# EAGLE design Platine_2 (EAGLE 9.6.2)

## Sheet 1 of 2
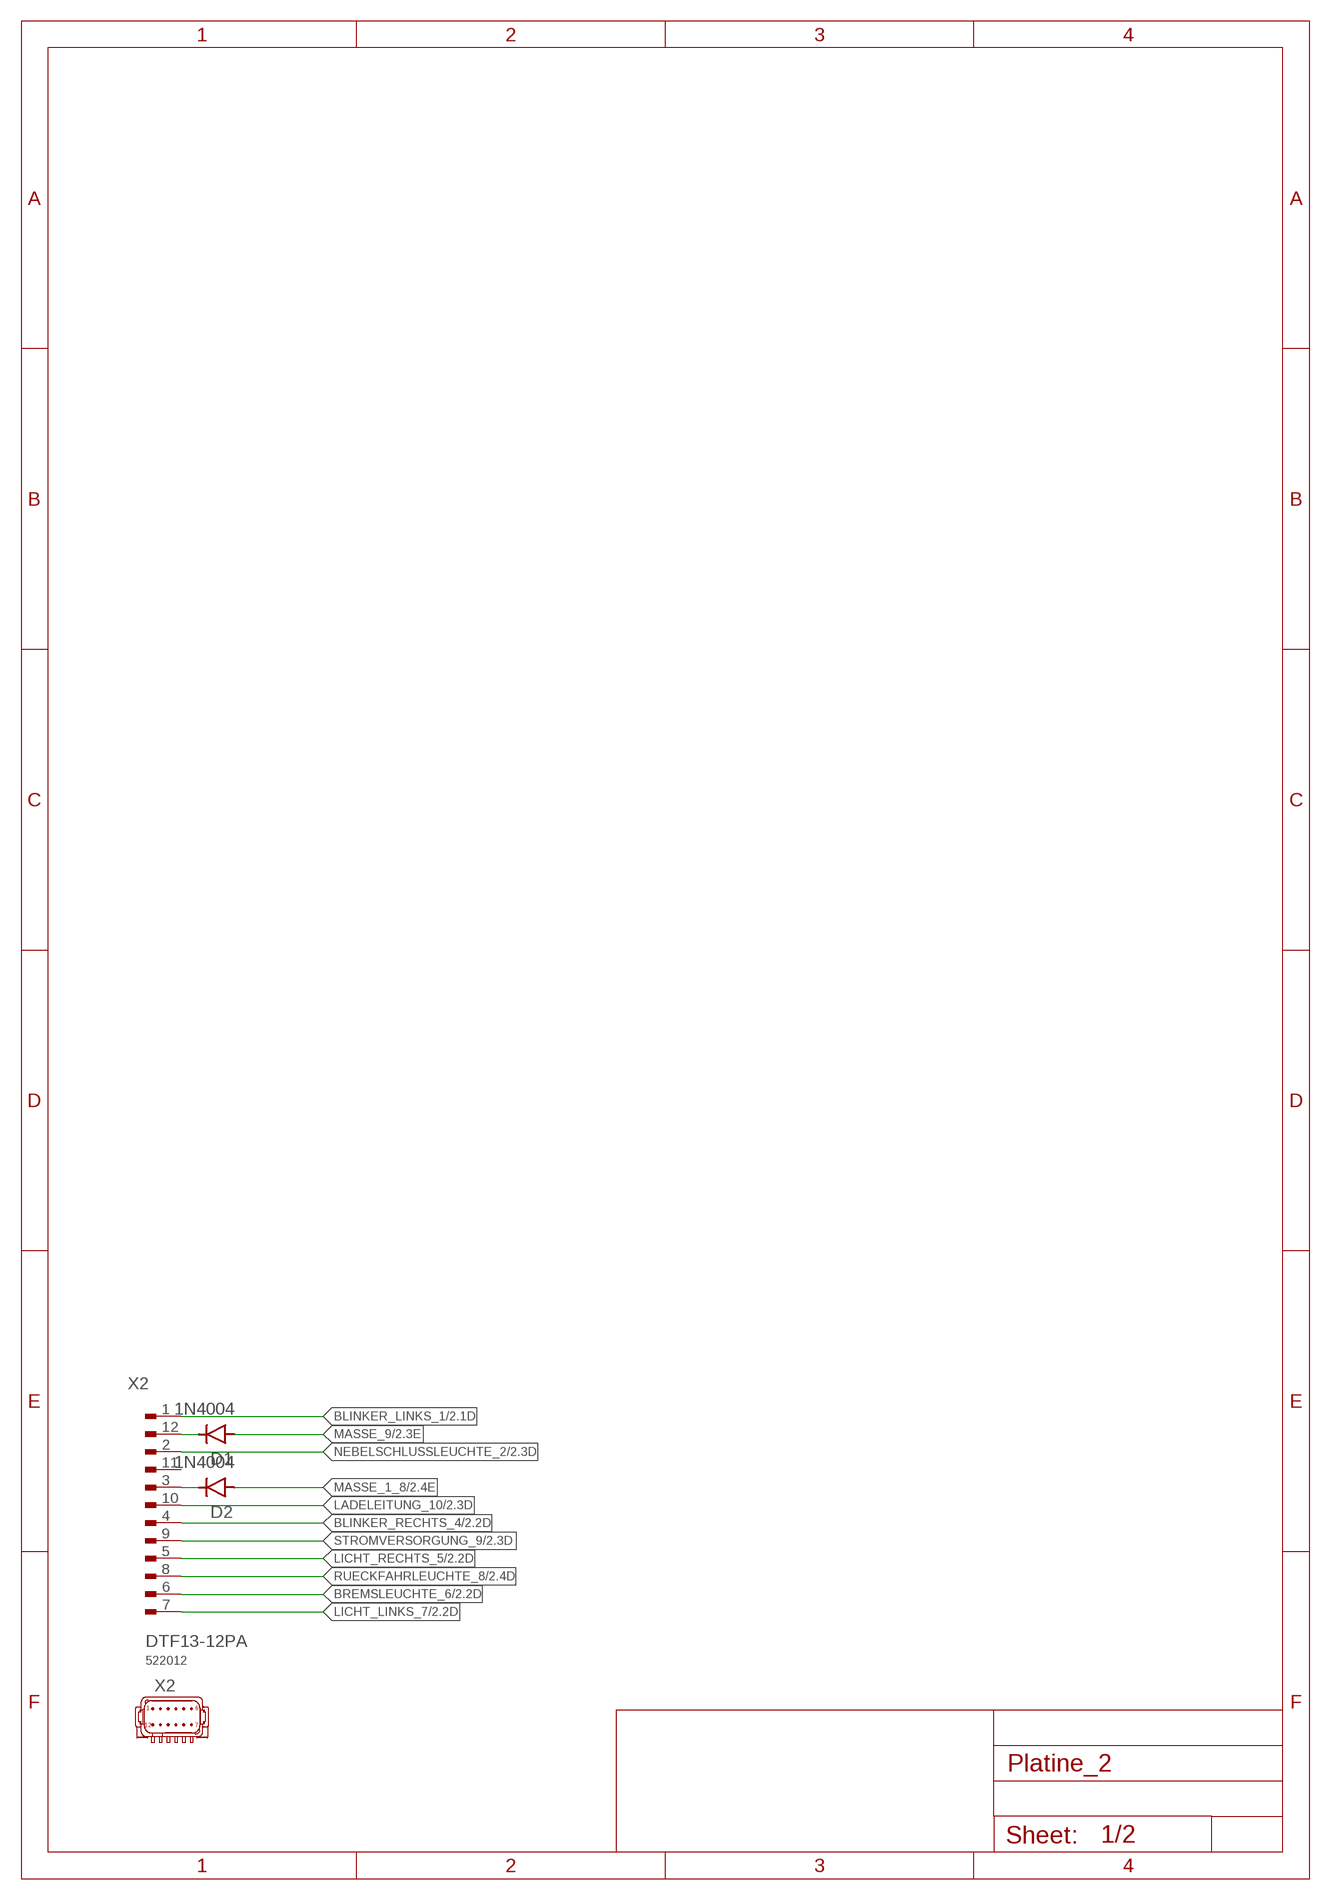
[diagram p0: schematic, sheet 1]

### Parts
D1  1N4004  [DO-41]
D2  1N4004  [DO-41]
X2  DTF13-12PA  [DTF13-12PA]

### Nets
BLINKER_LINKS_1: X2.1 ; also sheet 2
BLINKER_RECHTS_4: X2.4 ; also sheet 2
BREMSLEUCHTE_6: X2.6 ; also sheet 2
LADELEITUNG_10: X2.10 ; also sheet 2
LICHT_LINKS_7: X2.7 ; also sheet 2
LICHT_RECHTS_5: X2.5 ; also sheet 2
MASSE_1_8: D2.A ; also sheet 2
MASSE_9: D1.A ; also sheet 2
N$10: D1.C X2.12
N$11: D2.C X2.3
NEBELSCHLUSSLEUCHTE_2: X2.2 ; also sheet 2
RUECKFAHRLEUCHTE_8: X2.8 ; also sheet 2
STROMVERSORGUNG_9: X2.9 ; also sheet 2
Unconnected: X2.11

## Sheet 2 of 2
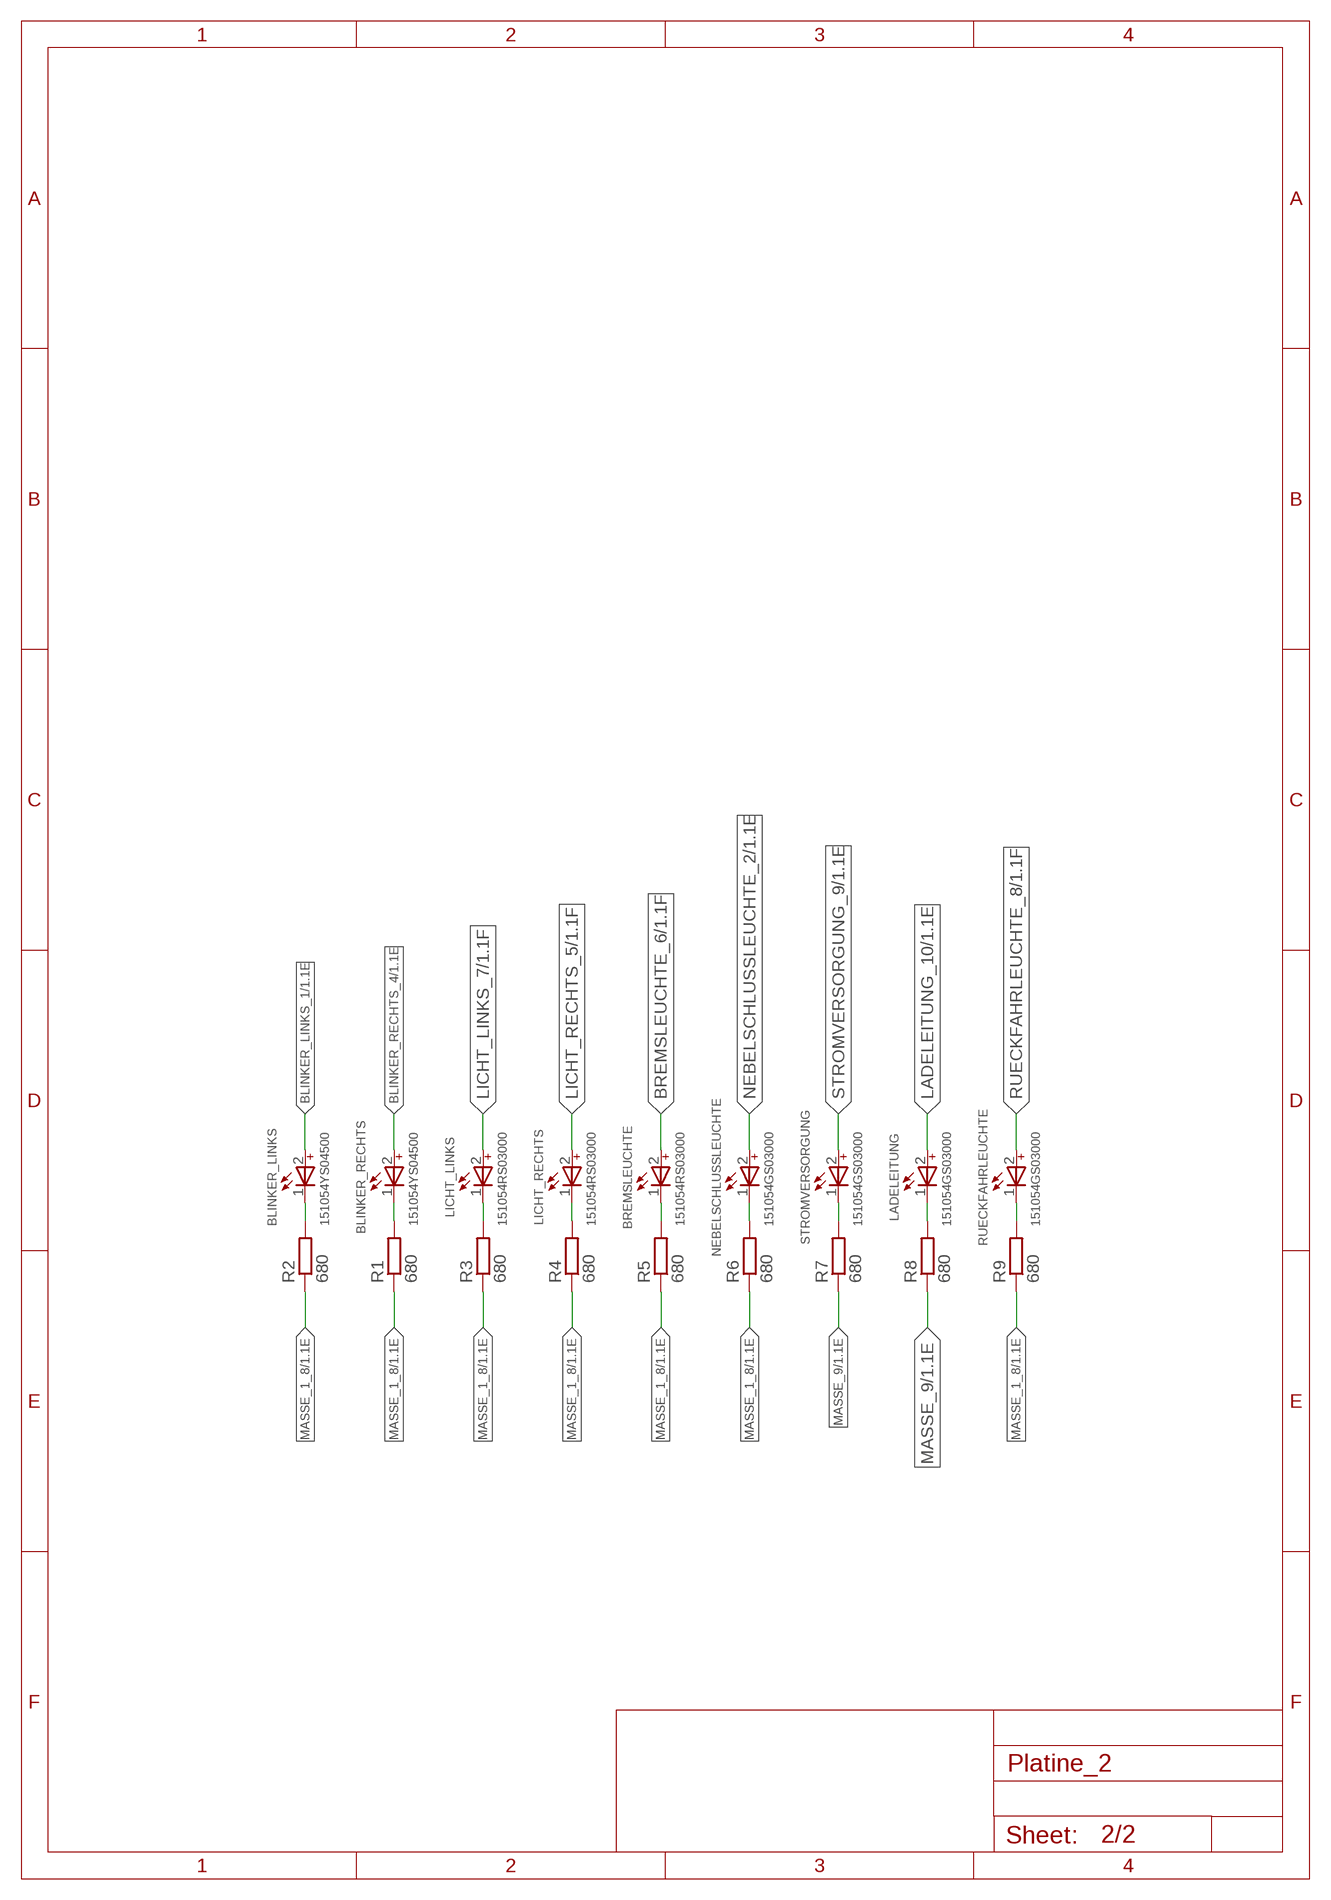
[diagram p1: schematic, sheet 2]

### Parts
BLINKER_LINKS  151054YS04500  WL-TMRW_5MM_151054YS04500_WITHOUTSTOPPER  [WL-TMRW_5MM]
BLINKER_RECHTS  151054YS04500  WL-TMRW_5MM_151054YS04500_WITHOUTSTOPPER  [WL-TMRW_5MM]
BREMSLEUCHTE  151054RS03000  WL-TMRW_5MM_151054RS03000_WITHOUTSTOPPER  [WL-TMRW_5MM]
LADELEITUNG  151054GS03000  WL-TMRW_5MM_151054GS03000_WITHOUTSTOPPER  [WL-TMRW_5MM]
LICHT_LINKS  151054RS03000  WL-TMRW_5MM_151054RS03000_WITHOUTSTOPPER  [WL-TMRW_5MM]
LICHT_RECHTS  151054RS03000  WL-TMRW_5MM_151054RS03000_WITHOUTSTOPPER  [WL-TMRW_5MM]
NEBELSCHLUSSLEUCHTE  151054GS03000  WL-TMRW_5MM_151054GS03000_WITHOUTSTOPPER  [WL-TMRW_5MM]
R1  680  R-EU_0204/7  [0204/7]
R2  680  R-EU_0204/7  [0204/7]
R3  680  R-EU_0204/7  [0204/7]
R4  680  R-EU_0204/7  [0204/7]
R5  680  R-EU_0204/7  [0204/7]
R6  680  R-EU_0204/7  [0204/7]
R7  680  R-EU_0204/7  [0204/7]
R8  680  R-EU_0204/7  [0204/7]
R9  680  R-EU_0204/7  [0204/7]
RUECKFAHRLEUCHTE  151054GS03000  WL-TMRW_5MM_151054GS03000_WITHOUTSTOPPER  [WL-TMRW_5MM]
STROMVERSORGUNG  151054GS03000  WL-TMRW_5MM_151054GS03000_WITHOUTSTOPPER  [WL-TMRW_5MM]

### Nets
BLINKER_LINKS_1: BLINKER_LINKS.2(+) ; also sheet 1
BLINKER_RECHTS_4: BLINKER_RECHTS.2(+) ; also sheet 1
BREMSLEUCHTE_6: BREMSLEUCHTE.2(+) ; also sheet 1
LADELEITUNG_10: LADELEITUNG.2(+) ; also sheet 1
LICHT_LINKS_7: LICHT_LINKS.2(+) ; also sheet 1
LICHT_RECHTS_5: LICHT_RECHTS.2(+) ; also sheet 1
MASSE_1_8: R1.1 R2.1 R3.1 R4.1 R5.1 R6.1 R9.1 ; also sheet 1
MASSE_9: R7.1 R8.1 ; also sheet 1
N$1: LICHT_LINKS.1(-) R3.2
N$2: LICHT_RECHTS.1(-) R4.2
N$3: BLINKER_LINKS.1(-) R2.2
N$4: BREMSLEUCHTE.1(-) R5.2
N$5: BLINKER_RECHTS.1(-) R1.2
N$6: NEBELSCHLUSSLEUCHTE.1(-) R6.2
N$7: R7.2 STROMVERSORGUNG.1(-)
N$8: LADELEITUNG.1(-) R8.2
N$9: R9.2 RUECKFAHRLEUCHTE.1(-)
NEBELSCHLUSSLEUCHTE_2: NEBELSCHLUSSLEUCHTE.2(+) ; also sheet 1
RUECKFAHRLEUCHTE_8: RUECKFAHRLEUCHTE.2(+) ; also sheet 1
STROMVERSORGUNG_9: STROMVERSORGUNG.2(+) ; also sheet 1

## Library data of the parts
BLINKER_LINKS BLINKER_RECHTS = Wurth_LEDs_WL-TMRW:WL-TMRW_5MM: WL-TMRW THT Mono-color Round Waterclear Characteristics Low energy consumption High reliability Low current requirement Fast switching No UV/IR radiation Easy installation Ultra high luminous efficacy Versatile mounting on PC boards With and without stopper Applications Indicator light Displays Traffic signal light Marker lights Commercial outdoor advertising Energy saving lamp Backlight LED Displays Electronic and optical indicator PBC mounted panel indicator Variable message sign <https://www.we-online.com/catalog/media/o14911v209%20Family_TMRW_THT.jpg> Details see: www.we-online.com/catalog/en/WL-TMRW <www.we-online.com/catalog/WL-TMRW/?utm_source=eagle_model&utm_medium=description_link&utm_campaign=eisos_eagle> Updated by Ella 2022-06-21 2022(C) Wurth Elektronik; CHIP-TECHNOLOGY: AlInGaP; DATASHEET-URL: https://www.we-online.com/redexpert/spec/151054YS04500?ae; DOMINANT-WAVELENGTH: 590nm; EMITTING-COLOR: Yellow; FORWARD-VOLTAGE: 2.1V; LUMINOUS-INTENSITY: 1500mcd; PART-NUMBER: 151054YS04500; PEAK-WAVELENGTH: 592nm; VIEWING-ANGLE: 45°
BREMSLEUCHTE LICHT_LINKS LICHT_RECHTS = Wurth_LEDs_WL-TMRW:WL-TMRW_5MM: WL-TMRW THT Mono-color Round Waterclear Characteristics Low energy consumption High reliability Low current requirement Fast switching No UV/IR radiation Easy installation Ultra high luminous efficacy Versatile mounting on PC boards With and without stopper Applications Indicator light Displays Traffic signal light Marker lights Commercial outdoor advertising Energy saving lamp Backlight LED Displays Electronic and optical indicator PBC mounted panel indicator Variable message sign <https://www.we-online.com/catalog/media/o14911v209%20Family_TMRW_THT.jpg> Details see: www.we-online.com/catalog/en/WL-TMRW <www.we-online.com/catalog/WL-TMRW/?utm_source=eagle_model&utm_medium=description_link&utm_campaign=eisos_eagle> Updated by Ella 2022-06-21 2022(C) Wurth Elektronik; CHIP-TECHNOLOGY: AlInGaP; DATASHEET-URL: https://www.we-online.com/redexpert/spec/151054RS03000?ae; DOMINANT-WAVELENGTH: 623nm; EMITTING-COLOR: Red; FORWARD-VOLTAGE: 1.9V; LUMINOUS-INTENSITY: 5000mcd; PART-NUMBER: 151054RS03000; PEAK-WAVELENGTH: 631nm; VIEWING-ANGLE: 30°
D1 D2 = Diodes:1N4004: DIODE GEN PURP 400V 1A DO41 Manufacturer's datasheet <https://www.mccsemi.com/pdf/Products/1N4001-1N4007(DO-41).pdf>; CREATED_BY: PCBLayout.com; DIGIKEY_PART_NUMBER: 1N4004MSCT-ND; MANUFACTURER: Micro Commercial Co; MPN: 1N4004; PACKAGE: DO-41
LADELEITUNG NEBELSCHLUSSLEUCHTE RUECKFAHRLEUCHTE STROMVERSORGUNG = Wurth_LEDs_WL-TMRW:WL-TMRW_5MM: WL-TMRW THT Mono-color Round Waterclear Characteristics Low energy consumption High reliability Low current requirement Fast switching No UV/IR radiation Easy installation Ultra high luminous efficacy Versatile mounting on PC boards With and without stopper Applications Indicator light Displays Traffic signal light Marker lights Commercial outdoor advertising Energy saving lamp Backlight LED Displays Electronic and optical indicator PBC mounted panel indicator Variable message sign <https://www.we-online.com/catalog/media/o14911v209%20Family_TMRW_THT.jpg> Details see: www.we-online.com/catalog/en/WL-TMRW <www.we-online.com/catalog/WL-TMRW/?utm_source=eagle_model&utm_medium=description_link&utm_campaign=eisos_eagle> Updated by Ella 2022-06-21 2022(C) Wurth Elektronik; CHIP-TECHNOLOGY: InGaN; DATASHEET-URL: https://www.we-online.com/redexpert/spec/151054GS03000?ae; DOMINANT-WAVELENGTH: 522nm; EMITTING-COLOR: Green; FORWARD-VOLTAGE: 3.4V; LUMINOUS-INTENSITY: 10000mcd; PART-NUMBER: 151054GS03000; PEAK-WAVELENGTH: 515nm; VIEWING-ANGLE: 30°
R1-R9 = resistor:R-EU_: RESISTOR, European symbol
X2 = DEUTSCH-PCB:DTF13-12PA: DTF13-12PA Connector System : Draht-an-Leiterplatte, Kabel-an-Gerät Alias NummerZPF000000000130557 Home-Page <http://www.te.com/deu-de/product-DTF13-12PA.html>; ARTIKEL_NR: 522012

## Board
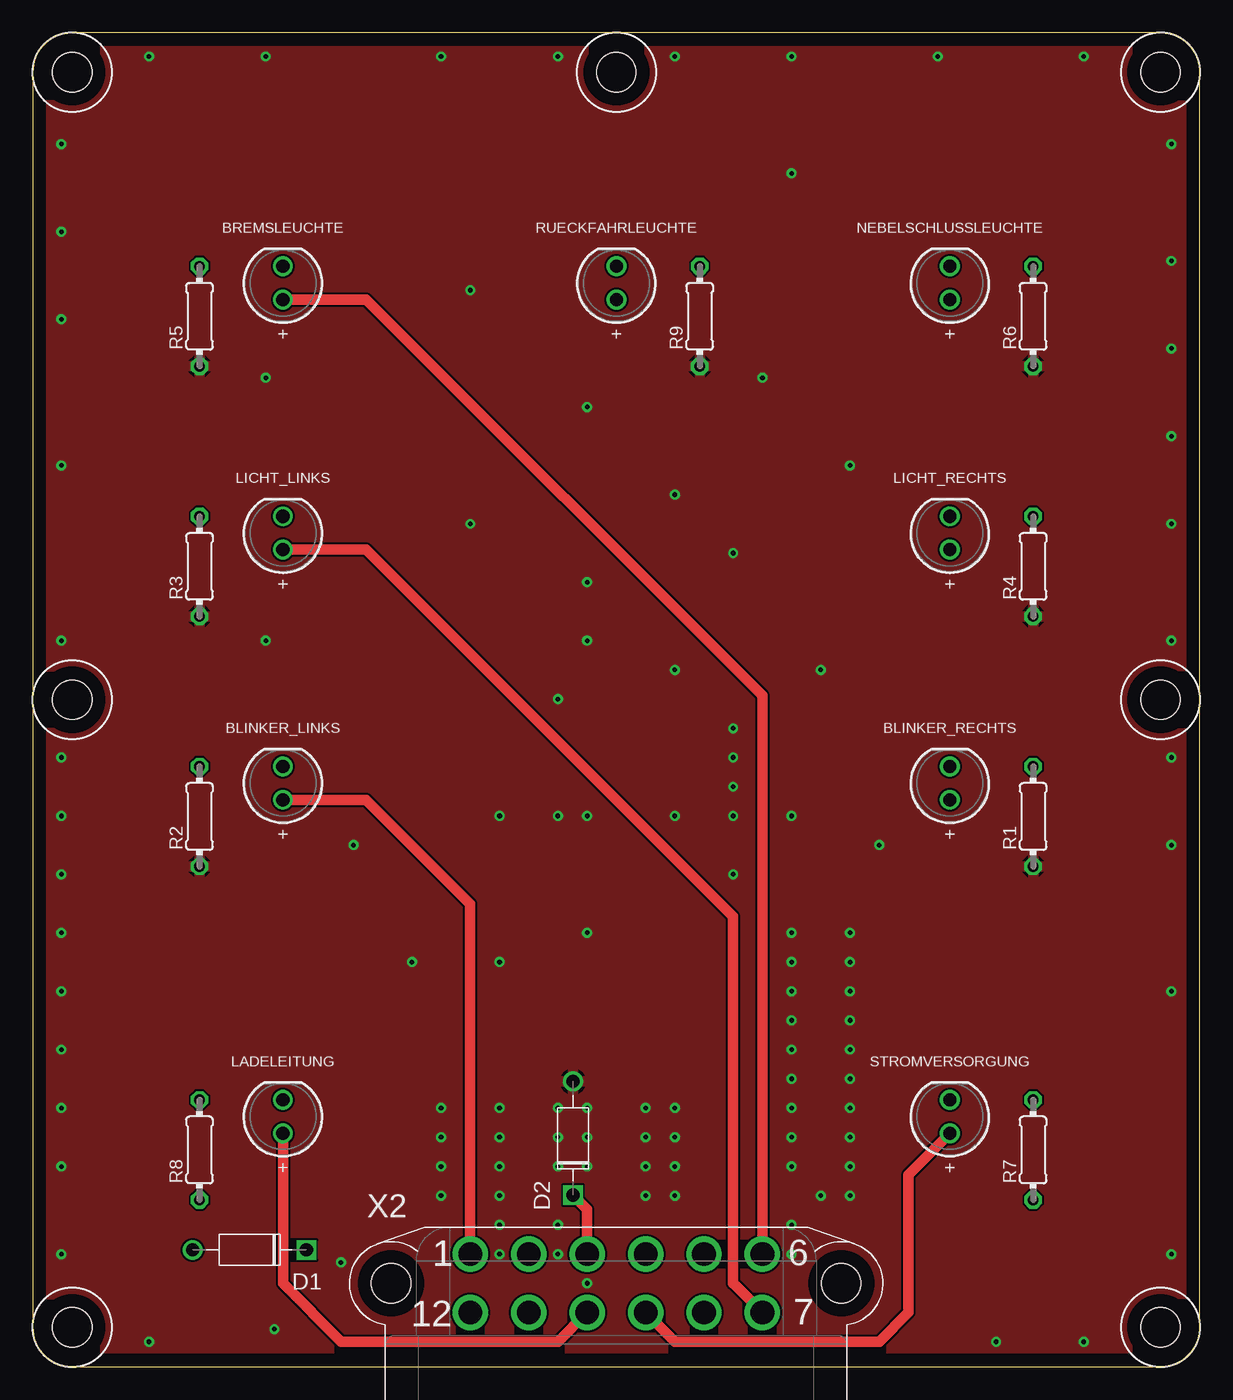
[diagram p2: board, top side]
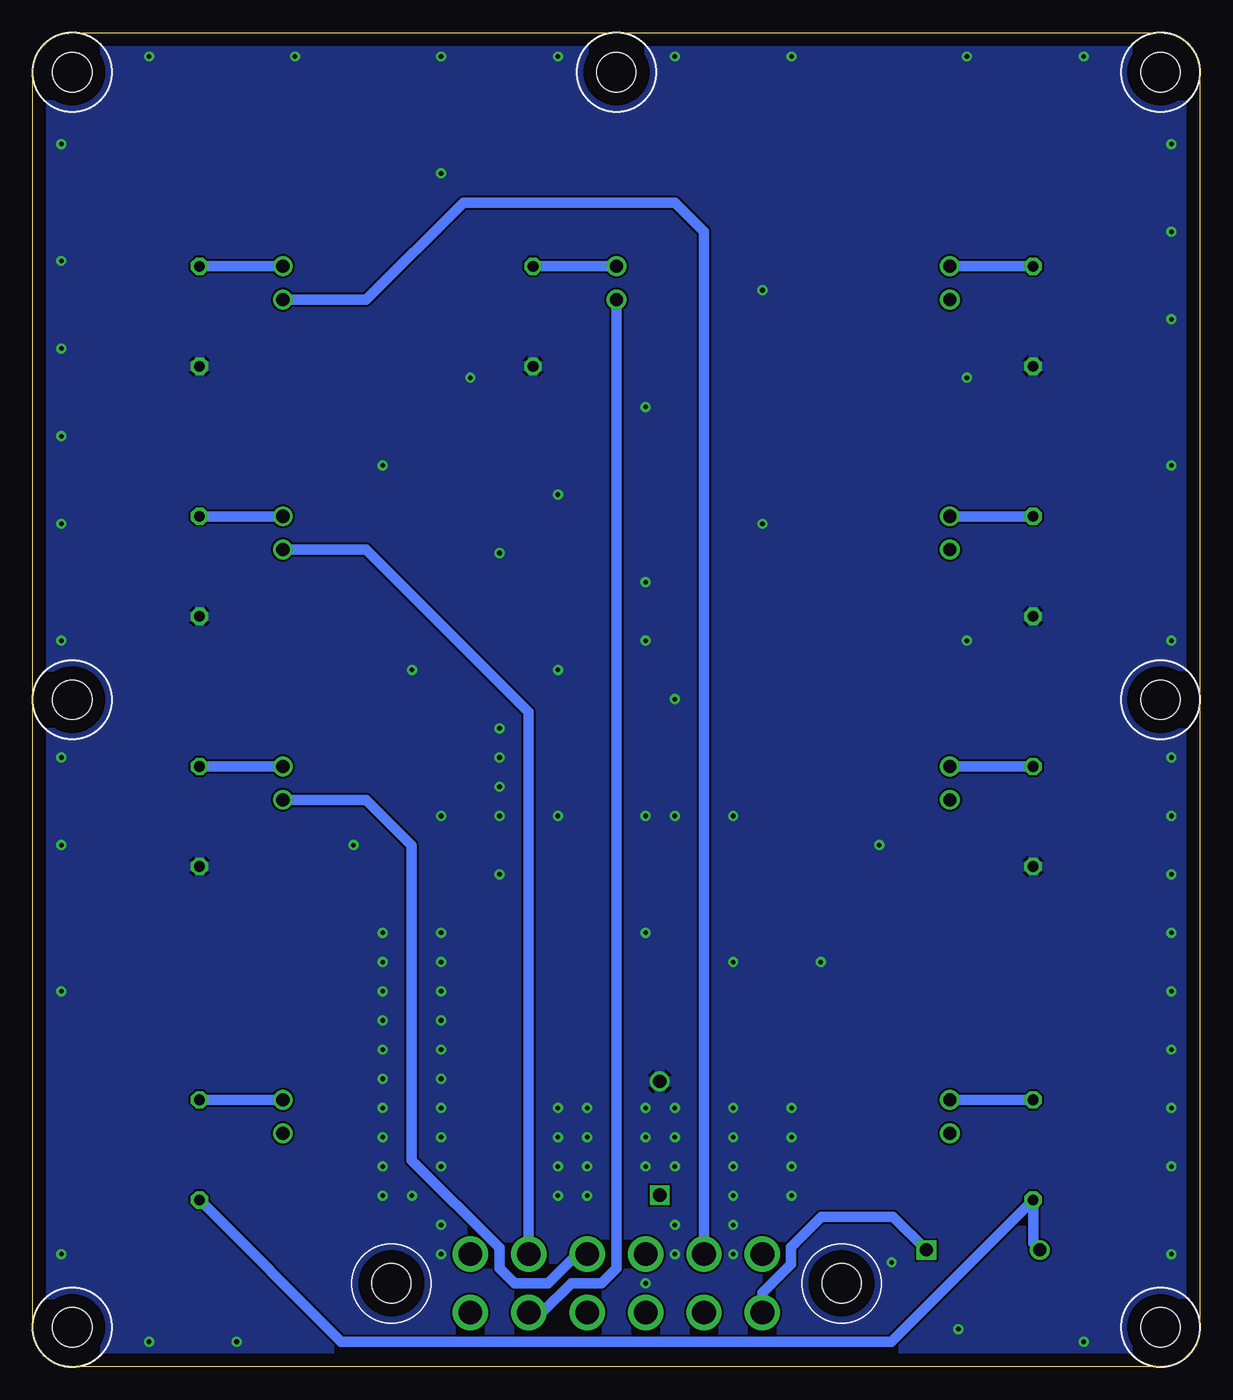
[diagram p3: board, bottom side, seen from below]

Size 88.9 x 101.6 mm. Coordinates in mm from the lower left corner, seen from the top.
Outline: 0,98.6 0,3 arc90 3,0 85.9,0 arc90 88.9,3 88.9,98.6 arc90 85.9,101.6 3,101.6 arc90 0,98.6
Copper layers (1*16): Top 0.035mm / dielectric 1.5mm / Bottom 0.035mm
Design rules "default *": minimum track width 6mil, minimum drill 0.35mm, track to track 6mil, track to pad 6mil, pad to pad 6mil, via to via 6mil, smd to smd 6mil, copper to edge 40mil, drill to drill 6mil, minimum pad ring 10mil, minimum via ring 8mil, stop-mask expansion 4mil, vias tented up to drill 100mil, thermal gap 10mil
Holes 3 mm at 3,98.6 85.9,98.6 85.9,3 3,3 44.45,98.6 85.9,50.8 3,50.8

### Footprints (pad centres in the part's own frame; a part is rotated, then mirrored left to right if it is on the bottom)
WL-TMRW_5MM = drill 1: 1 1.27,0; 2 -1.27,0
DO-41 = drill 1: A 4.325,0 | drill 1 square: C -4.325,0
0204/7 = drill 0.813 octagon: 1 -3.81,0; 2 3.81,0
DTF13-12PA = drill 1.8 pad 2.4: 1 -11.125,2.223; 2 -6.675,2.223; 3 -2.225,2.223; 4 2.225,2.223; 5 6.675,2.223; 6 11.125,2.223; 7 11.125,-2.223; 8 6.675,-2.223; 9 2.225,-2.223; 10 -2.225,-2.223; 11 -6.675,-2.223; 12 -11.125,-2.223 | hole 3: -17.157,0; 17.133,0

### Placement (x,y rotation side)
BLINKER_LINKS  Gelb  [WL-TMRW_5MM]  19.05,44.45 90 top
BLINKER_RECHTS  Gelb  [WL-TMRW_5MM]  69.85,44.45 90 top
BREMSLEUCHTE  Rot  [WL-TMRW_5MM]  19.05,82.55 90 top
D1  16.51,8.89 180 top
D2  41.15,17.4 90 top
LADELEITUNG  Grün  [WL-TMRW_5MM]  19.05,19.05 90 top
LICHT_LINKS  Rot  [WL-TMRW_5MM]  19.05,63.5 90 top
LICHT_RECHTS  Rot  [WL-TMRW_5MM]  69.85,63.5 90 top
NEBELSCHLUSSLEUCHTE  Grün  [WL-TMRW_5MM]  69.85,82.55 90 top
R1  76.2,41.91 90 top
R2  12.7,41.91 90 top
R3  12.7,60.96 90 top
R4  76.2,60.96 90 top
R5  12.7,80.01 90 top
R6  76.2,80.01 90 top
R7  76.2,16.51 90 top
R8  12.7,16.51 90 top
R9  50.8,80.01 90 top
RUECKFAHRLEUCHTE  Grün  [WL-TMRW_5MM]  44.45,82.55 90 top
STROMVERSORGUNG  Grün  [WL-TMRW_5MM]  69.85,19.05 90 top
X2  44.45,6.35 0 top

### Tracks (layer width: path | path; a pad name or v marks a point on that pad's centre or on a via)
BLINKER_LINKS_1
  Top 0.813: BLINKER_LINKS.2 25.4,43.18 33.33,35.26 X2.1
BLINKER_RECHTS_4
  Bottom 0.813: BLINKER_RECHTS.2 63.5,43.18 60.04,39.72 60.04,15.73 53.35,9.05 53.35,7.5 52.2,6.35 49.66,6.35 47.44,8.57 X2.4
BREMSLEUCHTE_6
  Top 0.813: BREMSLEUCHTE.2 25.4,81.28 55.58,51.11 X2.6
LADELEITUNG_10
  Top 0.813: X2.10 40,1.9 23.49,1.9 19.05,6.34 LADELEITUNG.2
LICHT_LINKS_7
  Top 0.813: LICHT_LINKS.2 25.4,62.23 53.35,34.28 53.35,6.35 X2.7
LICHT_RECHTS_5
  Bottom 0.813: LICHT_RECHTS.2 63.5,62.23 51.12,49.86 X2.5
MASSE_1_8  (via drill 0.35)
  other vias: 48.9,17.48 48.9,19.7 46.68,19.7 42.23,19.7 40,19.7 35.55,19.7 35.55,17.48 35.55,15.25 35.55,13.02 35.55,10.8 35.55,8.57 31.1,19.7 31.1,17.48 31.1,15.25 31.1,13.02 40,15.25 40,17.48 42.23,17.48 42.23,15.25 40,10.8 40,8.57 42.23,6.35 46.68,13.02 60.03,13.02 57.8,10.8 57.8,8.57 57.8,19.7 62.25,19.7 62.25,17.48 62.25,15.25 62.25,13.02 57.8,33.05 57.8,30.83 57.8,28.6 57.8,26.38 57.8,24.15 57.8,21.92 62.25,21.92 62.25,24.15 62.25,26.38 62.25,28.6 62.25,30.83 62.25,33.05 57.8,17.48 57.8,15.25 48.9,15.25 48.9,13.02 46.68,15.25 46.68,17.48 53.35,37.5 53.35,48.62 53.35,46.4 53.35,44.18 53.35,41.95 57.8,41.95 64.47,39.73 48.9,41.95 42.23,41.95 40,41.95 35.55,41.95 24.43,39.73 2.18,8.57 2.18,46.4 8.85,1.9 80.05,1.9 86.72,8.57 86.72,46.4 86.72,55.3 86.72,93.12 80.05,99.8 48.9,99.8 40,99.8 8.85,99.8 2.18,93.12 2.18,55.3 2.18,41.95 2.18,37.5 2.18,33.05 2.18,28.6 2.18,24.15 2.18,19.7 2.18,15.25 2.18,86.45 2.18,79.77 2.18,68.65 17.75,99.8 31.1,99.8 68.93,99.8 57.8,99.8 86.72,84.22 86.72,77.55 86.72,70.88 86.72,64.2 86.72,39.73 86.72,28.6 73.38,1.9 42.23,73.1 55.58,75.32 17.75,75.32 33.33,82 17.75,55.3 33.33,64.2 42.23,55.3 42.23,59.75 40,50.85 48.9,53.08 53.35,61.98 48.9,66.42 60.03,53.08 62.25,68.65 57.8,90.9 42.23,33.05 28.88,30.83 35.55,30.83 23.48,7.94 18.4,2.86
  pour Top: -6.35,107.95 95.25,107.95 95.25,-3.81 -6.35,-3.81
  pour Bottom: -6.35,107.95 95.25,107.95 95.25,-3.81 -6.35,-3.81
MASSE_9
  Bottom 0.813: 35.55,1.9 | R7.1 65.4,1.9 35.55,1.9 | D1.A 12.7,9.4 R8.1 23.5,1.9 31.1,1.9 35.55,1.9
N$1
  Bottom 0.813: LICHT_LINKS.1 R3.2
N$2
  Bottom 0.813: LICHT_RECHTS.1 R4.2
N$3
  Bottom 0.813: R2.2 BLINKER_LINKS.1
N$4
  Bottom 0.813: BREMSLEUCHTE.1 R5.2
N$5
  Bottom 0.813: BLINKER_RECHTS.1 R1.2
N$6
  Bottom 0.813: NEBELSCHLUSSLEUCHTE.1 R6.2
N$7
  Bottom 0.813: STROMVERSORGUNG.1 R7.2
N$8
  Bottom 0.813: R8.2 LADELEITUNG.1
N$9
  Bottom 0.813: RUECKFAHRLEUCHTE.1 R9.2
N$10
  Bottom 0.813: D1.C 23.38,11.43 28.83,11.43 31.16,9.1 31.16,7.78 33.33,5.62 X2.12
N$11
  Top 0.813: X2.3 42.23,12 D2.C
NEBELSCHLUSSLEUCHTE_2
  Bottom 0.813: NEBELSCHLUSSLEUCHTE.2 63.5,81.28 56.11,88.67 40,88.67 37.78,86.45 X2.2
RUECKFAHRLEUCHTE_8
  Bottom 0.813: RUECKFAHRLEUCHTE.2 44.45,7.49 45.59,6.35 47.88,6.35 50.11,4.13 X2.8
STROMVERSORGUNG_9
  Top 0.813: STROMVERSORGUNG.2 66.7,14.63 66.7,4.12 64.47,1.9 48.9,1.9 X2.9